# EAGLE design transformer_balancing (EAGLE 7.1.0)
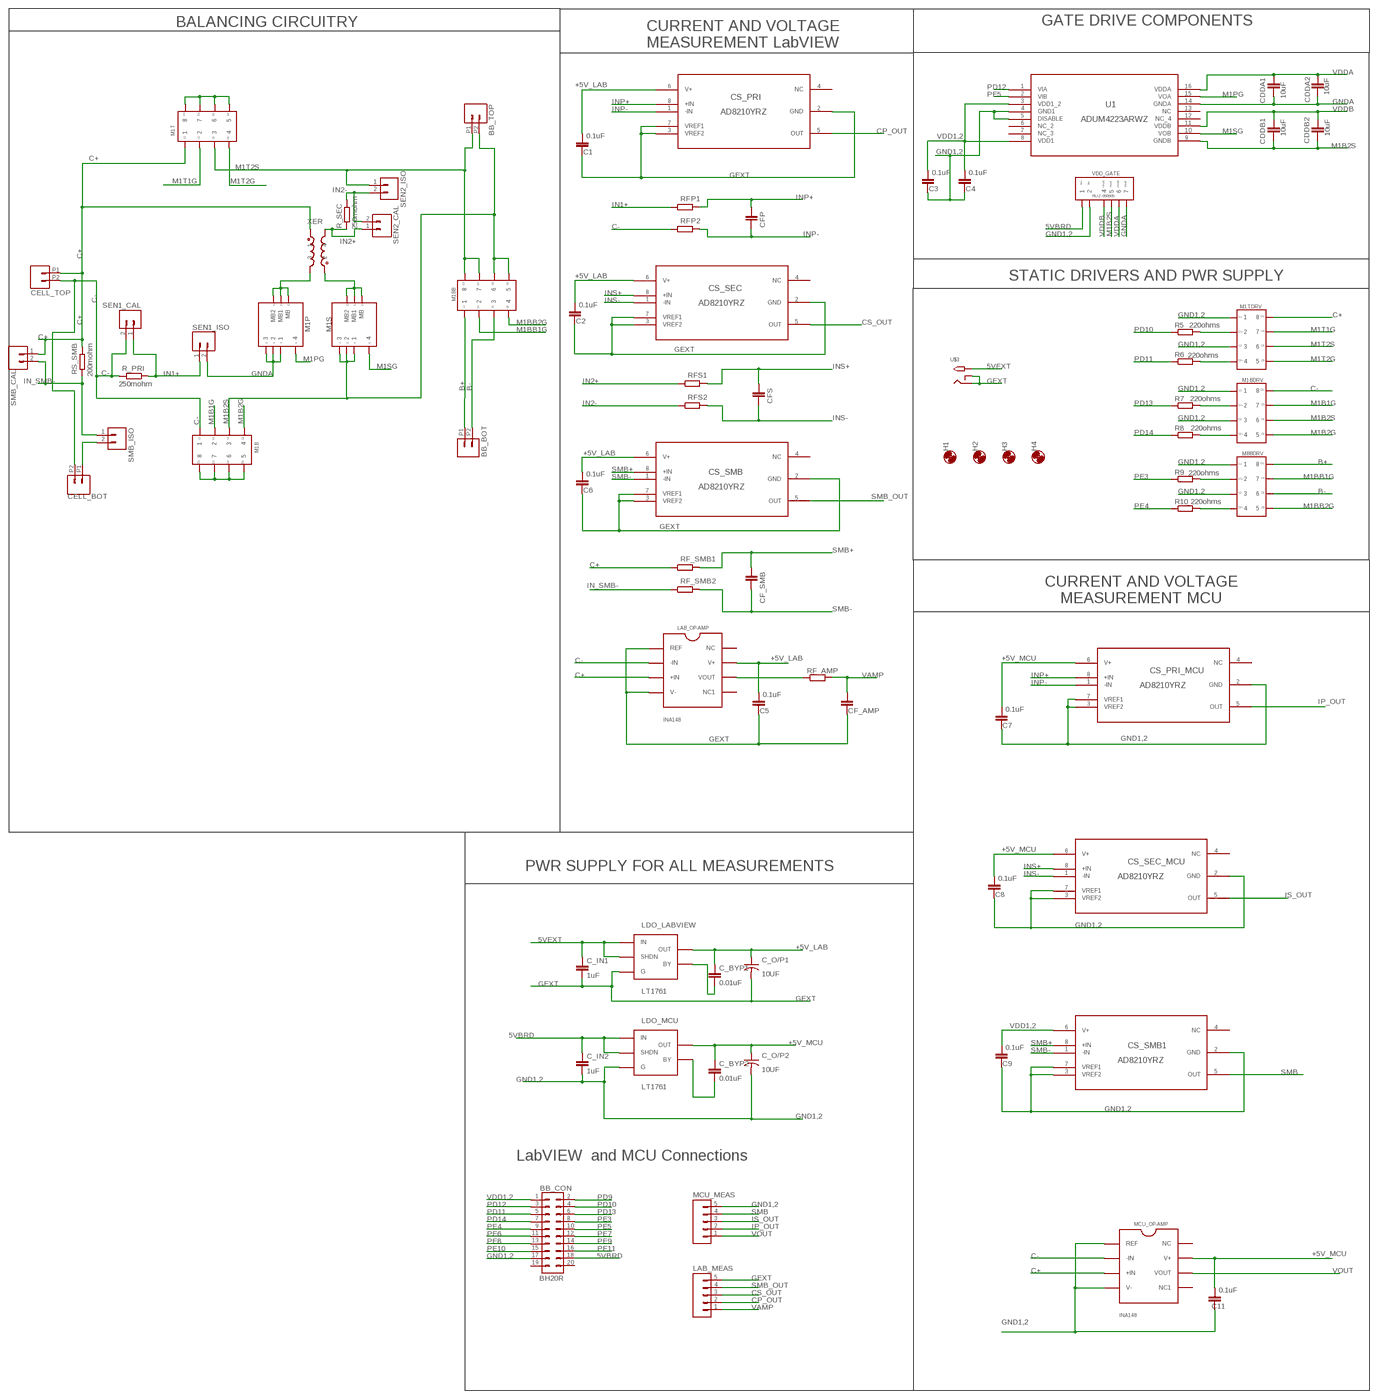
[diagram p0: schematic, sheet 1, overview]
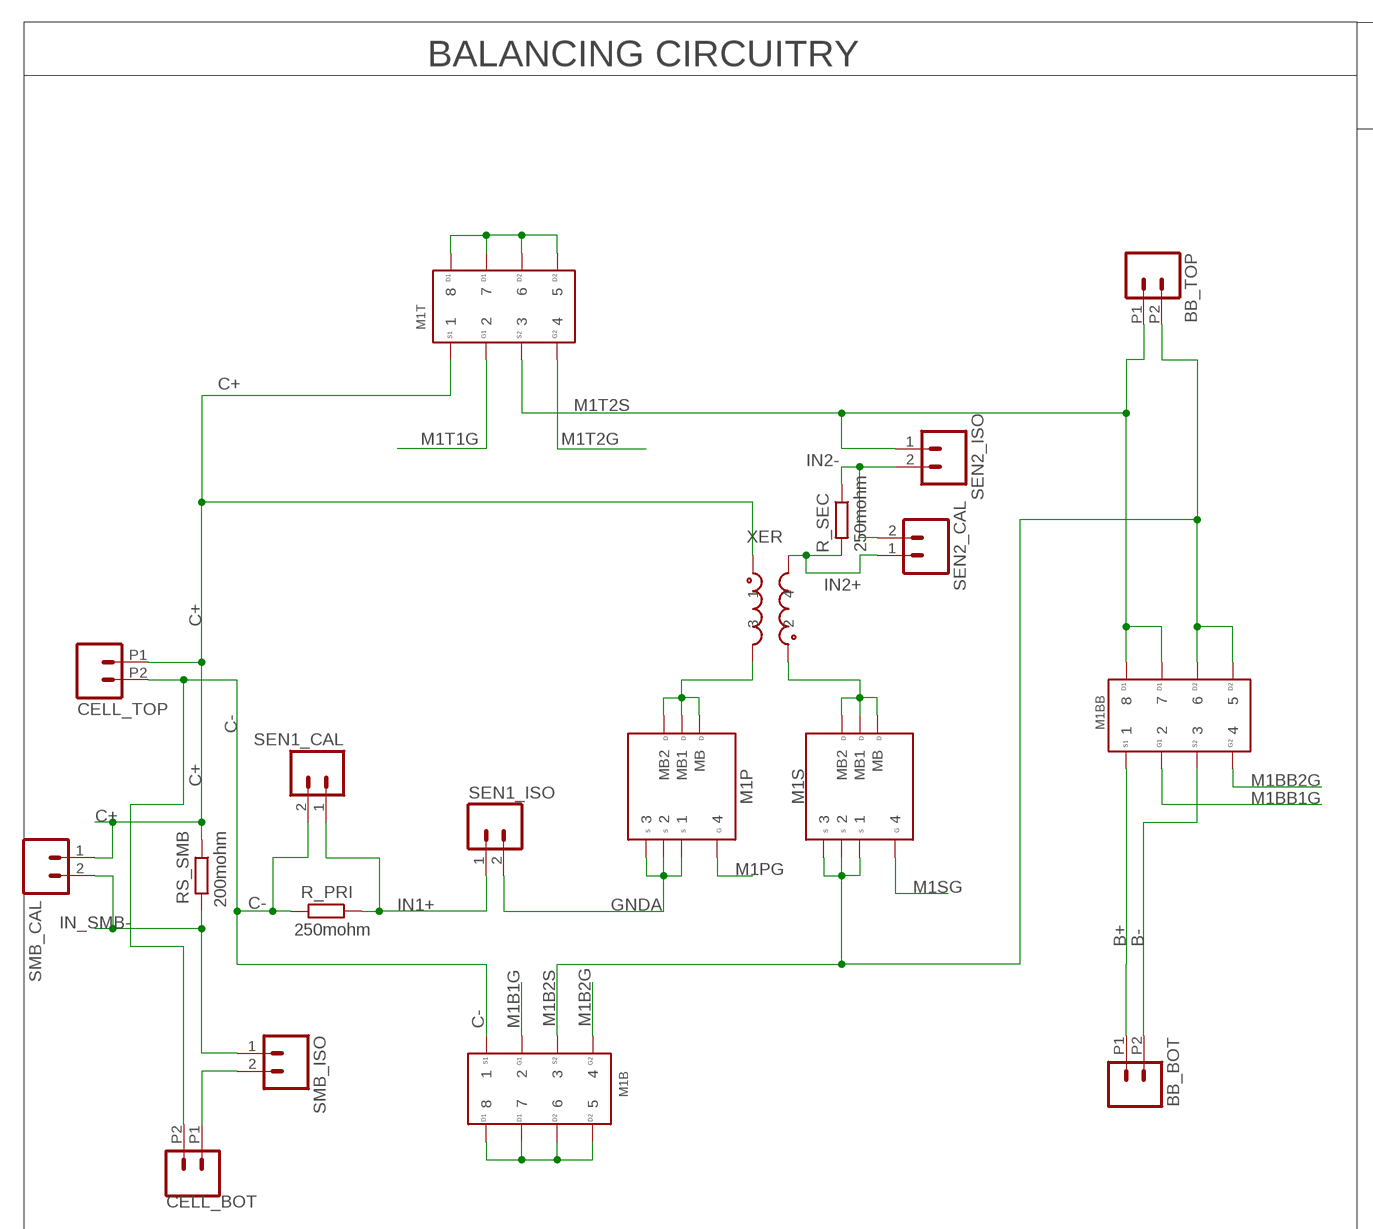
[diagram p1: schematic, sheet 1, part 1 of 4]
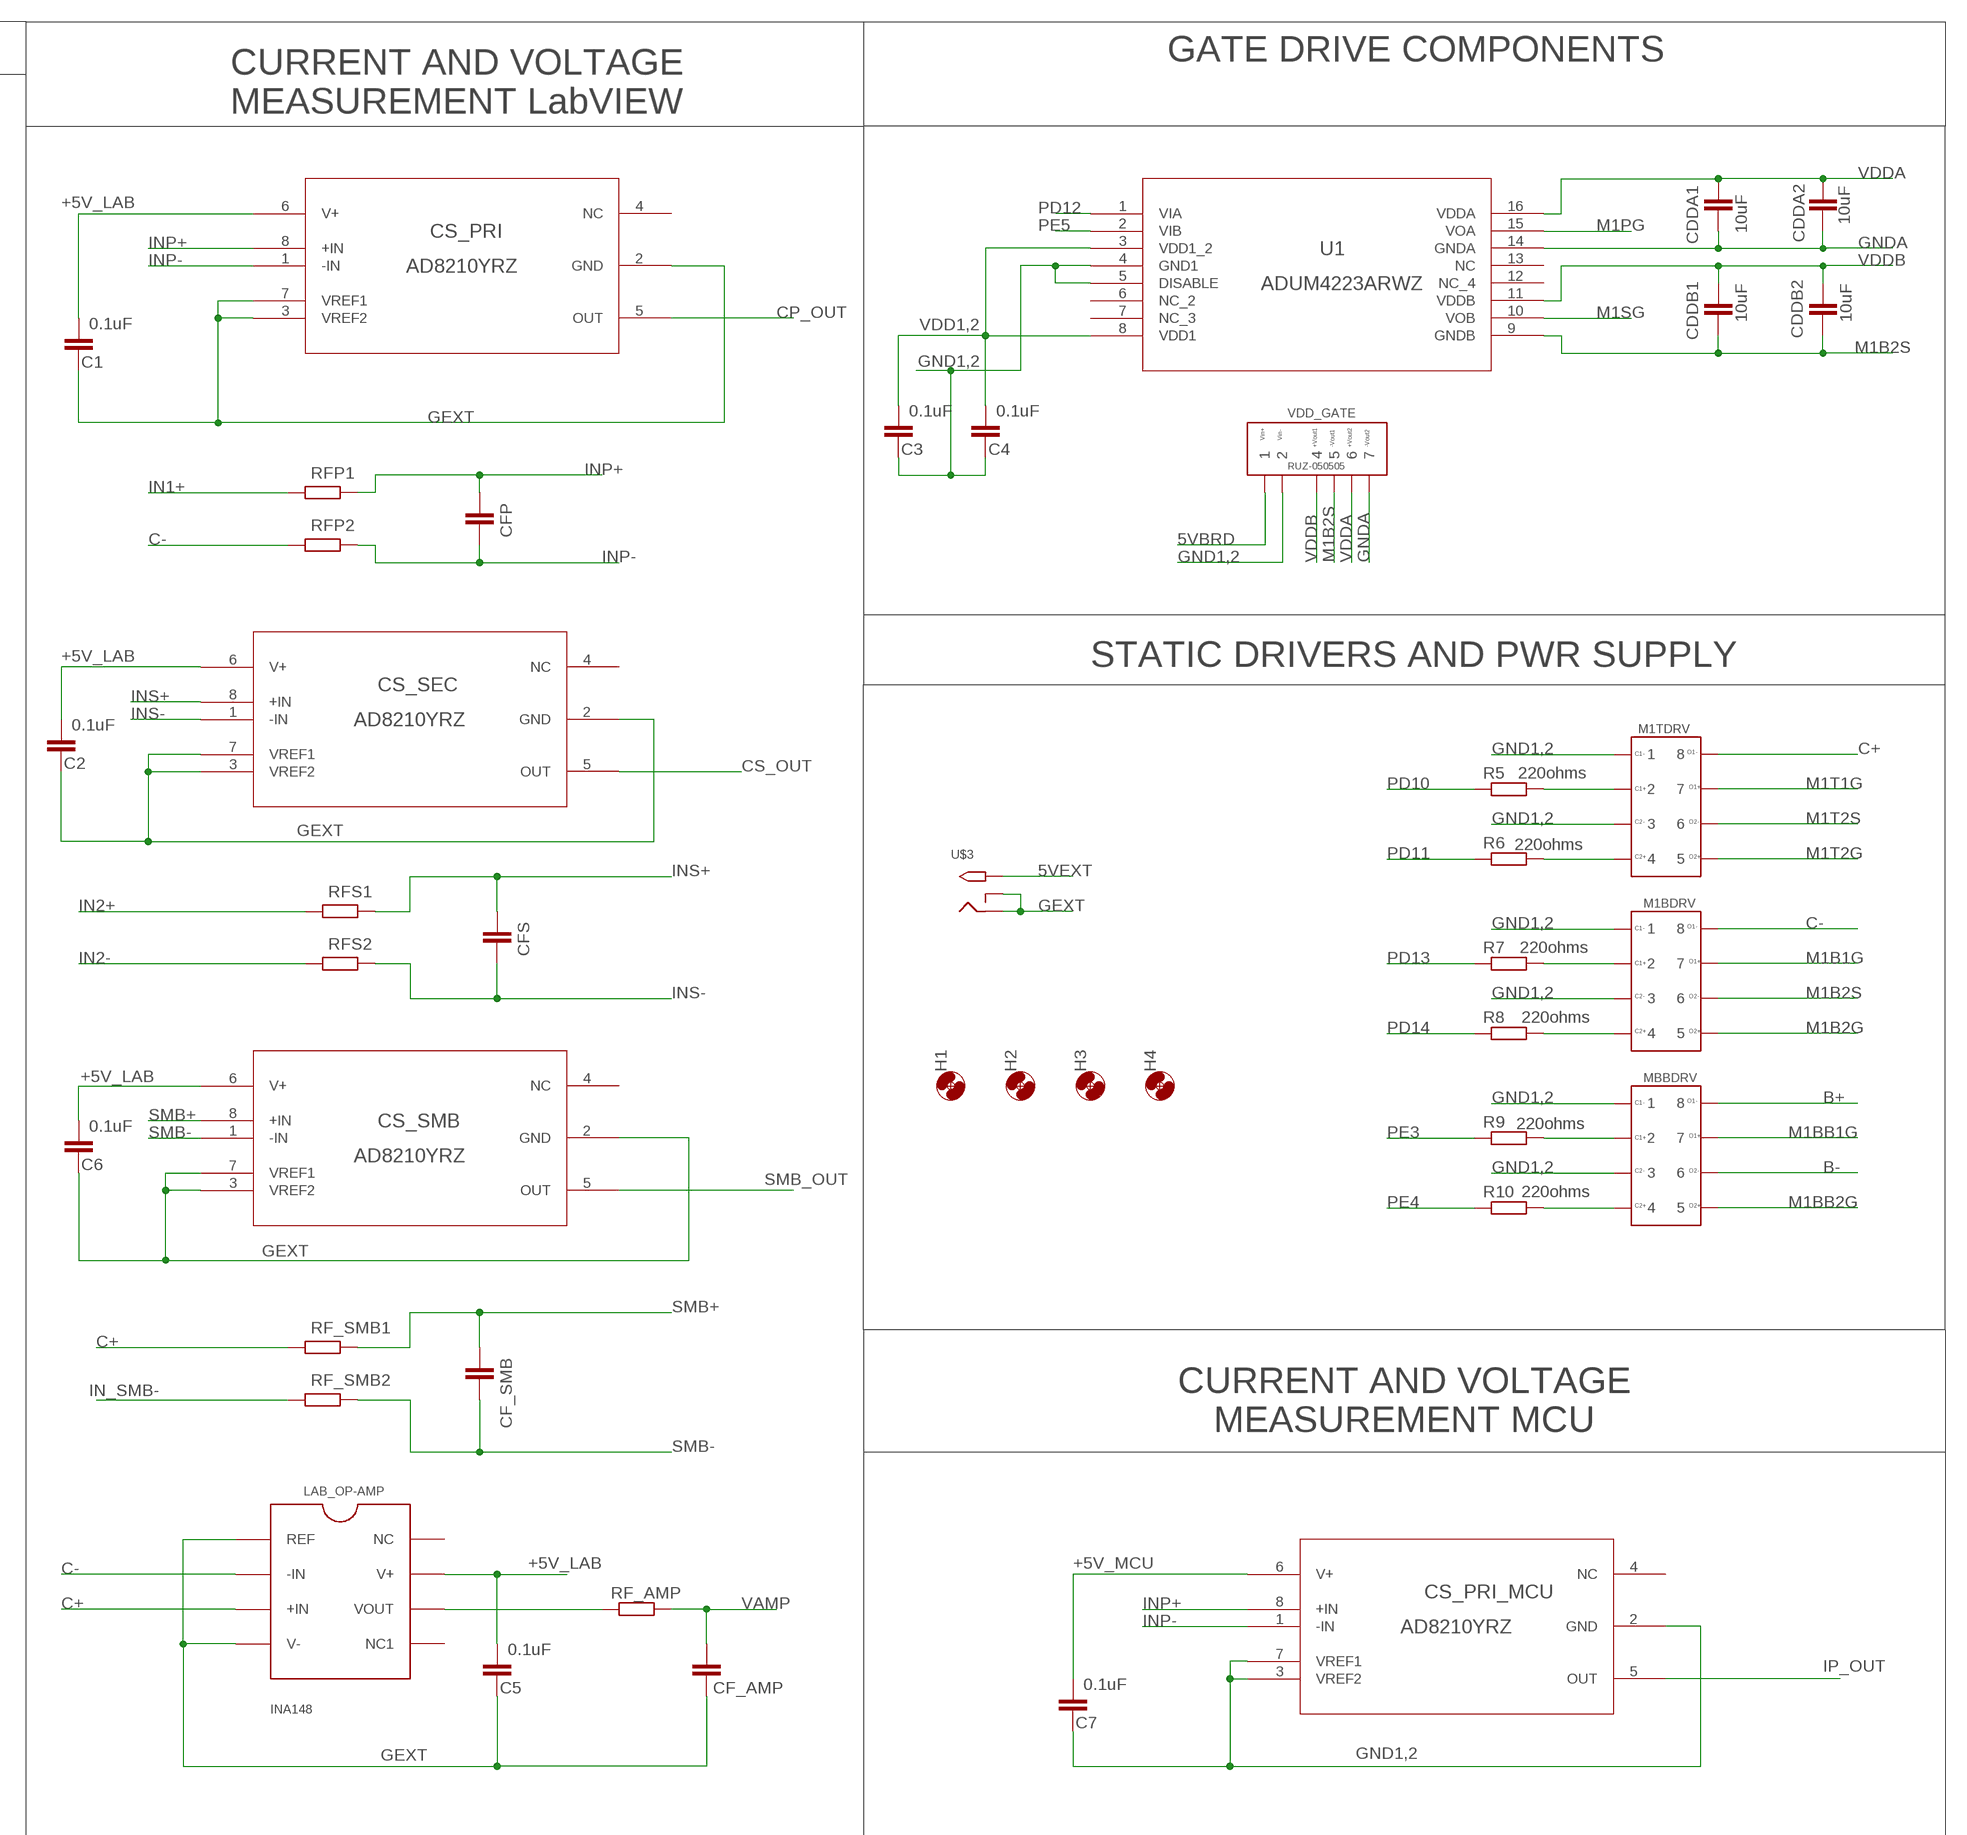
[diagram p2: schematic, sheet 1, part 2 of 4]
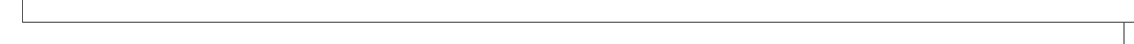
[diagram p3: schematic, sheet 1, part 3 of 4]
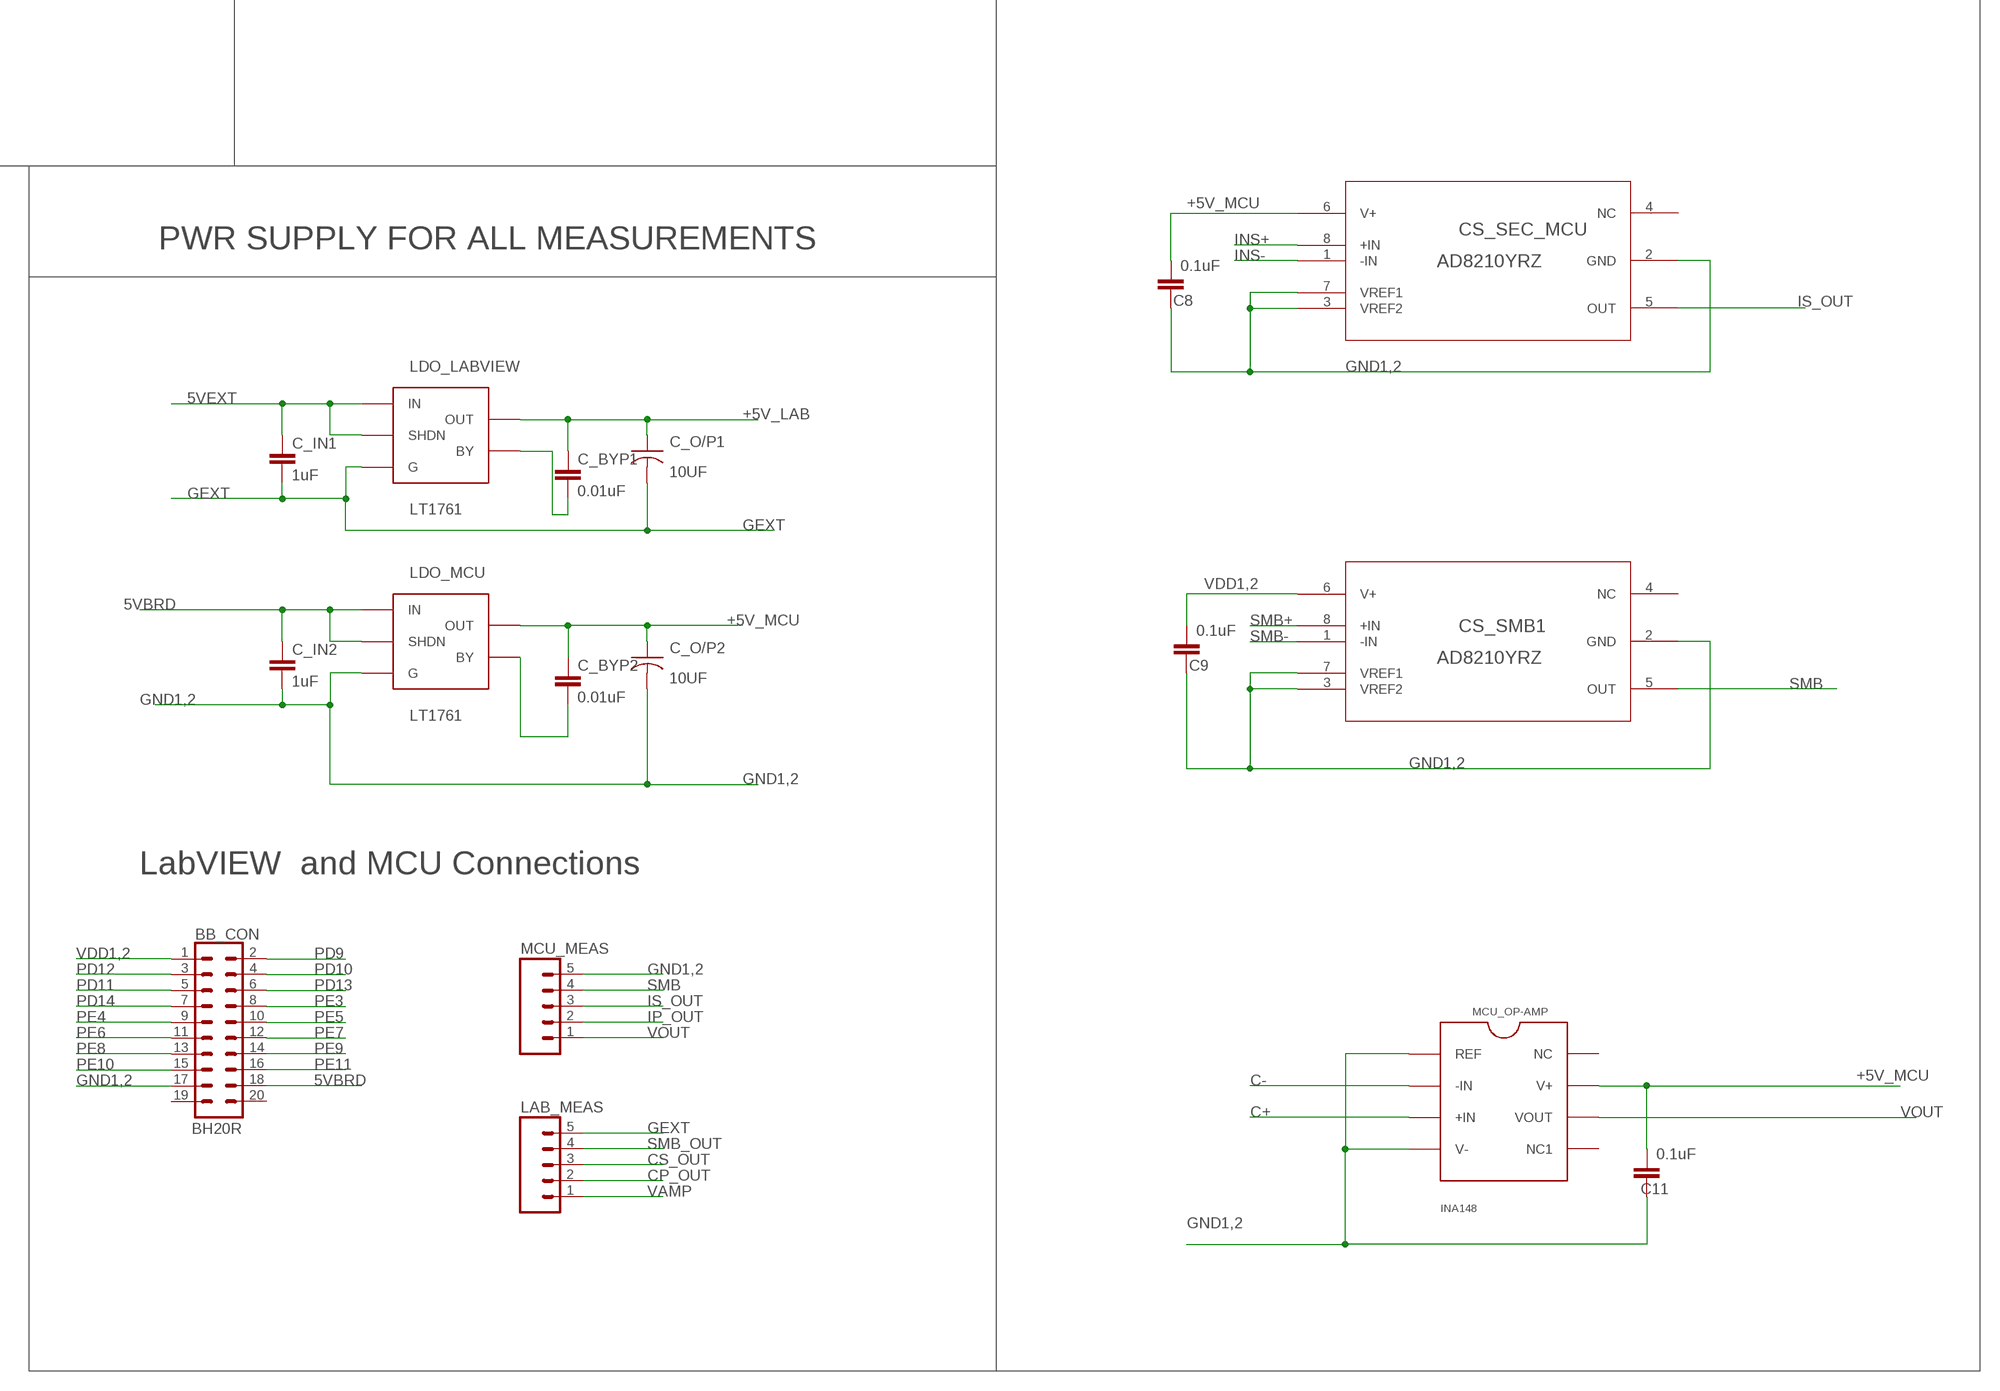
[diagram p4: schematic, sheet 1, part 4 of 4]

## Parts
BB_BOT  M022.54MM_SCREWTERM  [1X02_2.54_SCREWTERM]
BB_CON  BH20R  ML20R  [BH20R]
BB_TOP  M022.54MM_SCREWTERM  [1X02_2.54_SCREWTERM]
C1  0.1uF  C-EUC0603  [C0603]
C2  0.1uF  C-EUC0603  [C0603]
C3  0.1uF  C-EUC0603  [C0603]
C4  0.1uF  C-EUC0603  [C0603]
C5  0.1uF  C-EUC0603  [C0603]
C6  0.1uF  C-EUC0603  [C0603]
C7  0.1uF  C-EUC0603  [C0603]
C8  0.1uF  C-EUC0603  [C0603]
C9  0.1uF  C-EUC0603  [C0603]
C11  0.1uF  C-EUC0603  [C0603]
C_BYP1  0.01uF  C-EUC0402  [C0402]
C_BYP2  0.01uF  C-EUC0402  [C0402]
C_IN1  1uF  C-EUC0402  [C0402]
C_IN2  1uF  C-EUC0402  [C0402]
C_O/P1  10UF  10UF_O/P_LDO  [10UF_O/P_CAP_LDO]
C_O/P2  10UF  10UF_O/P_LDO  [10UF_O/P_CAP_LDO]
CDDA1  10uF  C-EUC0603  [C0603]
CDDA2  10uF  C-EUC0603  [C0603]
CDDB1  10uF  C-EUC0603  [C0603]
CDDB2  10uF  C-EUC0603  [C0603]
CELL_BOT  M022.54MM_SCREWTERM  [1X02_2.54_SCREWTERM]
CELL_TOP  M022.54MM_SCREWTERM  [1X02_2.54_SCREWTERM]
CF_AMP  C-EUC0603  [C0603]
CF_SMB  C-EUC0603  [C0603]
CFP  C-EUC0603  [C0603]
CFS  C-EUC0603  [C0603]
CS_PRI  AD8210YRZ  [R_8]
CS_PRI_MCU  AD8210YRZ  [R_8]
CS_SEC  AD8210YRZ  [R_8]
CS_SEC_MCU  AD8210YRZ  [R_8]
CS_SMB  AD8210YRZ  [R_8]
CS_SMB1  AD8210YRZ  [R_8]
H1  MOUNT-HOLE3.0  [3,0]
H2  MOUNT-HOLE3.0  [3,0]
H3  MOUNT-HOLE3.0  [3,0]
H4  MOUNT-HOLE3.0  [3,0]
LAB_MEAS  M05PTH  [1X05]
LAB_OP-AMP  INA148  [INA148]
LDO_LABVIEW  LT1761  [LT1761]
LDO_MCU  LT1761  [LT1761]
M1B  2_CHANNEL_MOSFET  [2_CHANNEL_MOSFET]
M1BB  2_CHANNEL_MOSFET  [2_CHANNEL_MOSFET]
M1BDRV  VOA1263  [VOA1263]
M1P  SWITCHING_MOSFET  [SWITCHING_MOSFET]
M1S  SWITCHING_MOSFET  [SWITCHING_MOSFET]
M1T  2_CHANNEL_MOSFET  [2_CHANNEL_MOSFET]
M1TDRV  VOA1263  [VOA1263]
MBBDRV  VOA1263  [VOA1263]
MCU_MEAS  M05PTH  [1X05]
MCU_OP-AMP  INA148  [INA148]
R5  220ohms  R-EU_R0603  [R0603]
R6  220ohms  R-EU_R0603  [R0603]
R7  220ohms  R-EU_R0603  [R0603]
R8  220ohms  R-EU_R0603  [R0603]
R9  220ohms  R-EU_R0603  [R0603]
R10  220ohms  R-EU_R0603  [R0603]
R_PRI  250mohm  R-EU_R0603  [R0603]
R_SEC  250mohm  R-EU_R0603  [R0603]
RF_AMP  R-EU_R0603  [R0603]
RF_SMB1  5R  R-EU_R0603  [R0603]
RF_SMB2  5R  R-EU_R0603  [R0603]
RFP1  5R  R-EU_R0603  [R0603]
RFP2  5R  R-EU_R0603  [R0603]
RFS1  5R  R-EU_R0603  [R0603]
RFS2  5R  R-EU_R0603  [R0603]
RS_SMB  200mohm  R-EU_R0603  [R0603]
SEN1_CAL  M02PTH  [1X02]
SEN1_ISO  M02PTH  [1X02]
SEN2_CAL  M02PTH  [1X02]
SEN2_ISO  M02PTH  [1X02]
SMB_CAL  M02PTH  [1X02]
SMB_ISO  M02PTH  [1X02]
U1  ADUM4223ARWZ  [RW_16]
U$3  2.1MMJACK  [PJ-102A]
VDD_GATE  RUZ-050505  [RUZ-050505]
XER  COUPLED_INDUCTOR  [COUPLED_INDUCTOR]

## Nets
5VBRD: BB_CON.18 C_IN2.1 LDO_MCU.1(IN) LDO_MCU.3(SHDN) VDD_GATE.1
5VEXT: C_IN1.1 LDO_LABVIEW.1(IN) LDO_LABVIEW.3(SHDN) U$3.TIP
+5V_LAB: C1.1 C2.1 C5.1 C6.1 C_BYP1.1 C_O/P1.1 CS_PRI.6(V+) CS_SEC.6(V+) CS_SMB.6(V+) LAB_OP-AMP.V+ LDO_LABVIEW.5(OUT)
+5V_MCU: C7.1 C8.1 C11.1 C_BYP2.1 C_O/P2.1 CS_PRI_MCU.6(V+) CS_SEC_MCU.6(V+) LDO_MCU.5(OUT) MCU_OP-AMP.V+
B+: BB_BOT.P1 M1BB.1 MBBDRV.8
B-: BB_BOT.P2 M1BB.3 MBBDRV.6
C+: CELL_TOP.P1 LAB_OP-AMP.+IN M1T.1 M1TDRV.8 MCU_OP-AMP.+IN RF_SMB1.1 RS_SMB.1 SMB_CAL.1 XER.1
C-: CELL_BOT.P2 CELL_TOP.P2 LAB_OP-AMP.-IN M1B.1 M1BDRV.8 MCU_OP-AMP.-IN R_PRI.2 RFP2.1 SEN1_CAL.2
CP_OUT: CS_PRI.5(OUT) LAB_MEAS.2
CS_OUT: CS_SEC.5(OUT) LAB_MEAS.3
GEXT: C1.2 C2.2 C5.2 C6.2 C_IN1.2 C_O/P1.2 CF_AMP.2 CS_PRI.2(GND) CS_PRI.3(VREF2) CS_PRI.7(VREF1) CS_SEC.2(GND) CS_SEC.3(VREF2) CS_SEC.7(VREF1) CS_SMB.2(GND) CS_SMB.3(VREF2) CS_SMB.7(VREF1) LAB_MEAS.5 LAB_OP-AMP.REF LAB_OP-AMP.V- LDO_LABVIEW.2(G) U$3.RING U$3.RING_SW
GND1,2: BB_CON.17 C3.2 C4.2 C7.2 C8.2 C9.2 C11.2 C_IN2.2 C_O/P2.2 CS_PRI_MCU.2(GND) CS_PRI_MCU.3(VREF2) CS_PRI_MCU.7(VREF1) CS_SEC_MCU.2(GND) CS_SEC_MCU.3(VREF2) CS_SEC_MCU.7(VREF1) CS_SMB1.2(GND) CS_SMB1.3(VREF2) CS_SMB1.7(VREF1) LDO_MCU.2(G) M1BDRV.1 M1BDRV.3 M1TDRV.1 M1TDRV.3 MBBDRV.1 MBBDRV.3 MCU_MEAS.5 MCU_OP-AMP.REF MCU_OP-AMP.V- U1.4(GND1) U1.5(DISABLE) VDD_GATE.2
GNDA: CDDA1.2 CDDA2.2 M1P.1 M1P.2 M1P.3 SEN1_ISO.2 U1.14(GNDA) VDD_GATE.7
IN1+: R_PRI.1 RFP1.1 SEN1_CAL.1 SEN1_ISO.1
IN2+: R_SEC.2 RFS1.1 SEN2_CAL.1 XER.4
IN2-: R_SEC.1 RFS2.1 SEN2_CAL.2 SEN2_ISO.2
IN_SMB-: RF_SMB2.1 RS_SMB.2 SMB_CAL.2 SMB_ISO.1
INP+: CFP.1 CS_PRI.8(+IN) CS_PRI_MCU.8(+IN) RFP1.2
INP-: CFP.2 CS_PRI.1(-IN) CS_PRI_MCU.1(-IN) RFP2.2
INS+: CFS.1 CS_SEC.8(+IN) CS_SEC_MCU.8(+IN) RFS1.2
INS-: CFS.2 CS_SEC.1(-IN) CS_SEC_MCU.1(-IN) RFS2.2
IP_OUT: CS_PRI_MCU.5(OUT) MCU_MEAS.2
IS_OUT: CS_SEC_MCU.5(OUT) MCU_MEAS.3
M1B1G: M1B.2 M1BDRV.7
M1B2G: M1B.4 M1BDRV.5
M1B2S: BB_TOP.P2 CDDB1.2 CDDB2.2 M1B.3 M1BB.5 M1BB.6 M1BDRV.6 M1S.1 M1S.2 M1S.3 U1.9(GNDB) VDD_GATE.5
M1BB1G: M1BB.2 MBBDRV.7
M1BB2G: M1BB.4 MBBDRV.5
M1PG: M1P.4 U1.15(VOA)
M1SG: M1S.4 U1.10(VOB)
M1T1G: M1T.2 M1TDRV.7
M1T2G: M1T.4 M1TDRV.5
M1T2S: BB_TOP.P1 M1BB.7 M1BB.8 M1T.3 M1TDRV.6 SEN2_ISO.1
N$1: M1T.5 M1T.6 M1T.7 M1T.8
N$2: M1TDRV.2 R5.2
N$3: M1P.MB M1P.MB1 M1P.MB2 XER.3
N$4: M1TDRV.4 R6.2
N$5: M1B.5 M1B.6 M1B.7 M1B.8
N$6: MBBDRV.2 R9.2
N$7: M1S.MB M1S.MB1 M1S.MB2 XER.2
N$8: MBBDRV.4 R10.2
N$9: M1BDRV.4 R8.2
N$10: LAB_OP-AMP.VOUT RF_AMP.1
N$11: M1BDRV.2 R7.2
N$13: CELL_BOT.P1 SMB_ISO.2
N$21: C_BYP1.2 LDO_LABVIEW.4(BY)
N$23: C_BYP2.2 LDO_MCU.4(BY)
PD9: BB_CON.2
PD10: BB_CON.4 R5.1
PD11 [thin]: BB_CON.5 R6.1
PD12: BB_CON.3 U1.1(VIA)
PD13: BB_CON.6 R7.1
PD14: BB_CON.7 R8.1
PE3: BB_CON.8 R9.1
PE4: BB_CON.9 R10.1
PE5: BB_CON.10 U1.2(VIB)
PE6: BB_CON.11
PE7 [thin]: BB_CON.12
PE8 [thin]: BB_CON.13
PE9: BB_CON.14
PE10: BB_CON.15
PE11: BB_CON.16
SMB: CS_SMB1.5(OUT) MCU_MEAS.4
SMB+: CF_SMB.1 CS_SMB1.8(+IN) CS_SMB.8(+IN) RF_SMB1.2
SMB-: CF_SMB.2 CS_SMB1.1(-IN) CS_SMB.1(-IN) RF_SMB2.2
SMB_OUT: CS_SMB.5(OUT) LAB_MEAS.4
VAMP: CF_AMP.1 LAB_MEAS.1 RF_AMP.2
VDD1,2: BB_CON.1 C3.1 C4.1 C9.1 CS_SMB1.6(V+) U1.3(VDD1_2) U1.8(VDD1)
VDDA: CDDA1.1 CDDA2.1 U1.16(VDDA) VDD_GATE.6
VDDB: CDDB1.1 CDDB2.1 U1.11(VDDB) VDD_GATE.4
VOUT: MCU_MEAS.1 MCU_OP-AMP.VOUT
Unconnected: BB_CON.19 BB_CON.20 CS_PRI.4(NC) CS_PRI_MCU.4(NC) CS_SEC.4(NC) CS_SEC_MCU.4(NC) CS_SMB1.4(NC) CS_SMB.4(NC) LAB_OP-AMP.NC LAB_OP-AMP.NC1 MCU_OP-AMP.NC MCU_OP-AMP.NC1 U1.6(NC_2) U1.7(NC_3) U1.12(NC_4) U1.13(NC)

## Notes on the sheet
- BALANCING CIRCUITRY | GATE DRIVE COMPONENTS
- CURRENT AND VOLTAGE 
  MEASUREMENT LabVIEW
- STATIC DRIVERS AND PWR SUPPLY
- CURRENT AND VOLTAGE
  MEASUREMENT MCU
- PWR SUPPLY FOR ALL MEASUREMENTS
- LabVIEW  and MCU Connections

## Library data of the parts
BB_BOT BB_TOP CELL_BOT CELL_TOP SEN1_CAL SEN1_ISO SEN2_CAL SEN2_ISO SMB_CAL SMB_ISO = SparkFun-Connectors:M02: Standard 2-pin 0.1" header. Use with - straight break away headers ( PRT-00116) - right angle break away headers (PRT-00553) - swiss pins (PRT-00743) - machine pins (PRT-00117) - female headers (PRT-00115) Molex polarized connector foot print use with: PRT-08233 with associated crimp pins and housings. 2.54_SCREWTERM for use with PRT-10571. 3.5mm Screw Terminal footprints for PRT-08084 5mm Screw Terminal footprints for use with PRT-08433
BB_CON = con-harting-ml:ML20: HARTING
C1-C9 C11 CDDA1 CDDA2 CDDB1 CDDB2 CF_AMP CF_SMB CFP CFS = resistor:C-EU: CAPACITOR, European symbol; SPICEPREFIX: C
C_BYP1 C_BYP2 C_IN1 C_IN2 = rcl:C-EU: CAPACITOR, European symbol
C_O/P1 C_O/P2 = transformer_Balancing:10UF_O/P_LDO
CS_PRI CS_PRI_MCU CS_SEC CS_SEC_MCU CS_SMB CS_SMB1 = SmartCellPrototype:AD8210YRZ
H1-H4 = holes:MOUNT-HOLE: MOUNTING HOLE with drill center marker
LAB_MEAS MCU_MEAS = SparkFun-Connectors:M05: Header 5 Standard 5-pin 0.1" header. Use with straight break away headers (SKU : PRT-00116), right angle break away headers (PRT-00553), swiss pins (PRT-00743), machine pins (PRT-00117), and female headers (PRT-00115). Molex polarized connector foot print use with SKU : PRT-08230 with associated crimp pins and housings.
LAB_OP-AMP MCU_OP-AMP = SmartCellPrototype:INA148
LDO_LABVIEW LDO_MCU = transformer_Balancing:LT1761
M1B M1BB M1T = transformer_Balancing:2_CHANNEL_MOSFET
M1BDRV M1TDRV MBBDRV = transformer_Balancing:VOA1263
M1P M1S = transformer_Balancing:SWITCHING_MOSFET
R5-R10 RF_AMP = resistor:R-EU_: RESISTOR, European symbol; SPICEPREFIX: R
R_PRI R_SEC RF_SMB1 RF_SMB2 RFP1 RFP2 RFS1 RFS2 RS_SMB = rcl:R-EU_: RESISTOR, European symbol
U1 = transformer_Balancing:ADUM4223ARWZ
U$3 = adafruit:2.1MMJACK: 2.1mm x 5.5mm DC jack with internal switch. Digikey part #PJ-102A, 4UCON part #05537 By microbuilder.eu
VDD_GATE = transformer_Balancing:RUZ-050505
XER = transformer_Balancing:COUPLED_INDUCTOR

## Net classes
2 thin: width 0.025 mm, clearance 0.025 mm

## Board
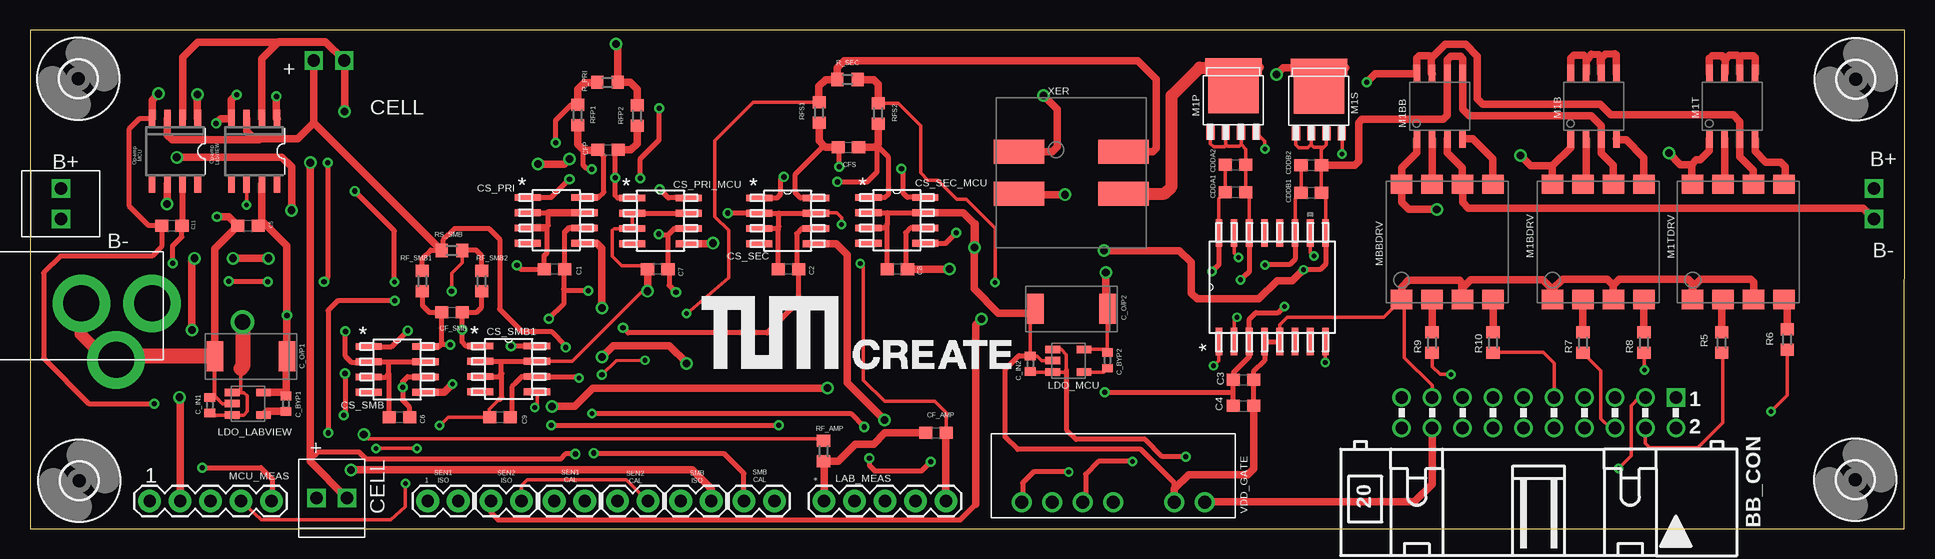
[diagram p5: board, top side]
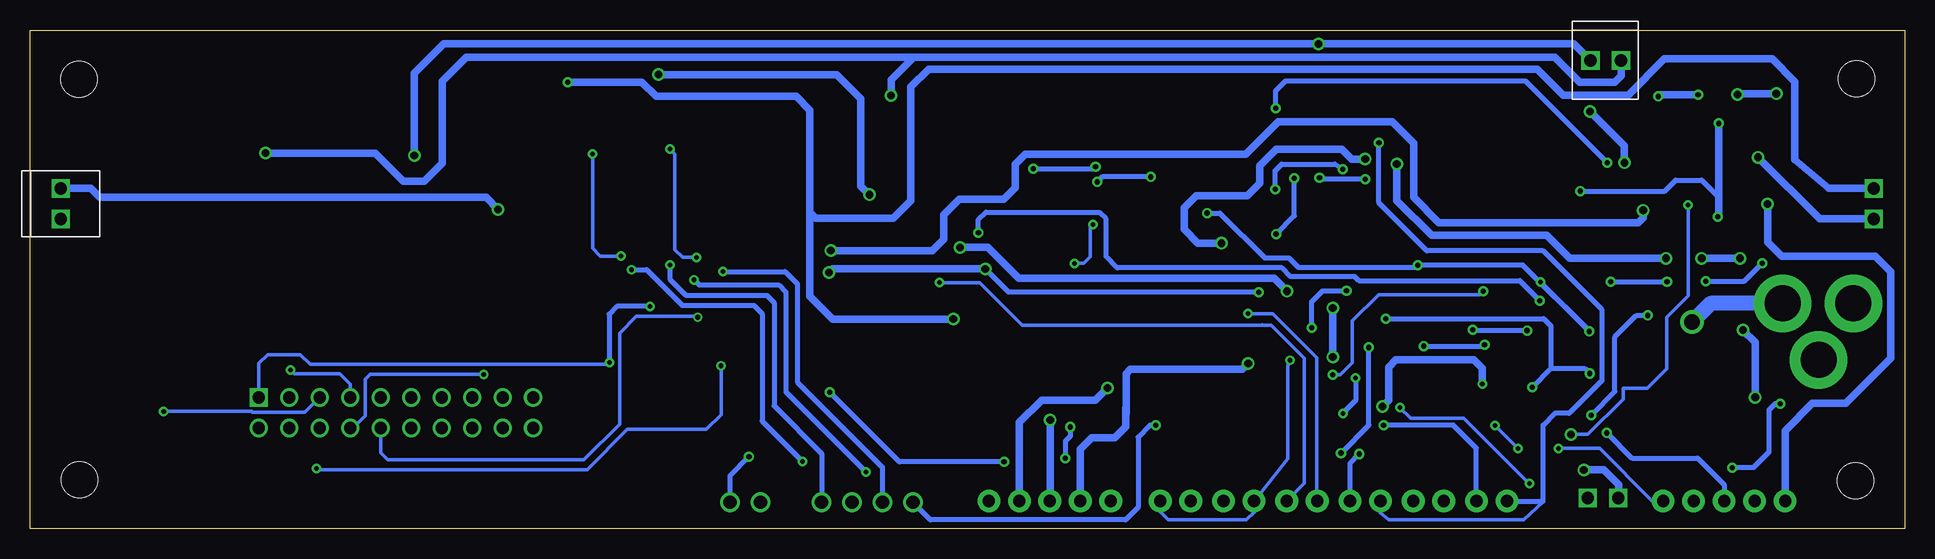
[diagram p6: board, bottom side, seen from below]

Size 156.23 x 41.54 mm. Coordinates in mm from the lower left corner, seen from the top.
Outline: 0,0 156.19,0 156.23,41.54 0,41.54 0,0
Copper layers (1*16): Top 0.0356mm / dielectric 1.5011mm / Bottom 0.0356mm
Design rules "SilverCircuits": minimum track width 7mil, minimum drill 14mil, track to track 7mil, track to pad 7mil, pad to pad 7mil, via to via 7mil, smd to smd 0mil, copper to edge 20mil, drill to drill 8mil, minimum pad ring 10mil, minimum via ring 8mil, stop-mask expansion 4mil, vias tented up to drill 0mil, thermal gap 10mil

### Footprints (pad centres in the part's own frame; a part is rotated, then mirrored left to right if it is on the bottom)
1X02_2.54_SCREWTERM = drill 1.016 square: P1 2.54,0; P2 0,0
BH20R = drill 1.016 square: 1 -11.43,-1.27 | drill 1.016: 2 -11.43,1.27; 3 -8.89,-1.27; 4 -8.89,1.27; 5 -6.35,-1.27; 6 -6.35,1.27; 7 -3.81,-1.27; 8 -3.81,1.27; 9 -1.27,-1.27; 10 -1.27,1.27; 11 1.27,-1.27; 12 1.27,1.27; 13 3.81,-1.27; 14 3.81,1.27; 15 6.35,-1.27; 16 6.35,1.27; 17 8.89,-1.27; 18 8.89,1.27; 19 11.43,-1.27; 20 11.43,1.27
C0603 = smd 1.1 x 1: 1 -0.85,0; 2 0.85,0
C0402 = smd 0.7 x 0.9: 1 -0.65,0; 2 0.65,0
10UF_O/P_CAP_LDO = smd 1.4 x 2.5: 1 -3,0; 2 3,0
R_8 = smd 2.184 x 0.559: 1 -2.362,1.905; 2 -2.362,0.635; 3 -2.362,-0.635; 4 -2.362,-1.905; 5 2.362,-1.905; 6 2.362,-0.635; 7 2.362,0.635; 8 2.362,1.905
3,0 = hole 3: 0,0
1X05 = drill 1.016 pad 1.88: 1 0,0; 2 2.54,0; 3 5.08,0; 4 7.62,0; 5 10.16,0
INA148 = smd 0.55 x 1.5: +IN 0.635,-2.7; -IN -0.635,-2.7; NC -1.905,2.7; NC1 1.905,2.7; REF -1.905,-2.7; V+ -0.635,2.7; V- 1.905,-2.7; VOUT 0.635,2.7
LT1761 = smd 0.62 x 1.22: 1 -0.95,-1.31; 2 0,-1.31; 3 0.95,-1.31; 4 0.95,1.31; 5 -0.95,1.31
2_CHANNEL_MOSFET = smd 0.55 x 1.5: 1 -1.905,-2.7; 2 -0.635,-2.7; 3 0.635,-2.7; 4 1.905,-2.7; 5 1.905,2.7; 6 0.635,2.7; 7 -0.635,2.7; 8 -1.905,2.7
VOA1263 = smd 1.6 x 1.8: 1 -4.8,3.81; 2 -4.8,1.27; 3 -4.8,-1.27; 4 -4.8,-3.81; 5 4.8,-3.81; 6 4.8,-1.27; 7 4.8,1.27; 8 4.8,3.81
SWITCHING_MOSFET = smd 0.7 x 1.15: 1 -1.905,-2.725; 2 -0.635,-2.725; 3 0.635,-2.725; 4 1.905,-2.725 | smd 4.2 x 4.6: MB 0,1.2 | smd 0.25 x 1.5: MB1 -2.225,2.75; MB2 2.225,2.75
R0603 = smd 1 x 1.1: 1 -0.85,0; 2 0.85,0
1X02 = drill 1.016 pad 1.88: 1 0,0; 2 2.54,0
RW_16 = smd 2.286 x 0.559: 1 -4.528,4.445; 2 -4.528,3.175; 3 -4.528,1.905; 4 -4.528,0.635; 5 -4.528,-0.635; 6 -4.528,-1.905; 7 -4.528,-3.175; 8 -4.528,-4.445; 9 4.528,-4.445; 10 4.528,-3.175; 11 4.528,-1.905; 12 4.528,-0.635; 13 4.528,0.635; 14 4.528,1.905; 15 4.528,3.175; 16 4.528,4.445
PJ-102A = drill 3 pad 4.8: RING 0.1,-3.39; RING_SW -4.6,-6.29; TIP 0.1,-9.29
RUZ-050505 = drill 1.1: 1 -5.08,0; 2 -2.54,0; 4 2.54,0; 5 5.08,0; 6 7.62,0; 7 10.16,0
COUPLED_INDUCTOR = smd 2 x 4.2: 1 1.75,4.35; 2 -1.75,4.35; 3 -1.75,-4.35; 4 1.75,-4.35

### Placement (x,y rotation side)
BB_BOT  153.67,25.79 90 bottom
BB_CON  125.73,9.65 180 top
BB_TOP  2.58,25.79 90 top
C1  43.7,21.6 180 top
C2  63.21,21.6 180 top
C3  101.12,12.38 0 top
C4  101.12,10.21 0 top
C5  18.17,25.22 180 top
C6  30.78,9.26 180 top
C7  52.31,21.6 180 top
C8  72.28,21.6 180 top
C9  39.17,9.26 180 top
C11  11.82,25.22 180 top
C_BYP1  21.34,10.4 270 top
C_BYP2  89.79,14.01 270 top
C_IN1  14.99,10.27 90 top
C_IN2  83.36,13.73 90 top
C_O/P1  18.41,14.34 180 top
C_O/P2  86.79,18.3 180 top
CDDA1  100.46,28.03 0 top
CDDA2  100.46,30.31 0 top
CDDB1  106.77,27.99 0 top
CDDB2  106.77,30.28 0 top
CELL_BOT  26.42,2.54 180 top
CELL_TOP  26.19,39 0 bottom
CF_AMP  75.5,7.96 0 top
CF_SMB  35.17,18.02 0 top
CFP  48.16,31.55 0 top
CFS  68.2,31.78 0 top
CS_PRI  43.85,25.68 0 top
CS_PRI_MCU  52.54,25.64 0 top
CS_SEC  63.13,25.64 0 top
CS_SEC_MCU  72.24,25.68 0 top
CS_SMB  30.59,13.26 0 top
CS_SMB1  39.89,13.3 0 top
H1  4.03,37.48 0 top
H2  152.15,37.44 0 top
H3  152.11,4.06 0 top
H4  4.1,3.99 0 top
LAB_MEAS  66.17,2.29 0 top
LAB_OP-AMP  18.68,31.45 180 top
LDO_LABVIEW  18.16,10.4 270 top
LDO_MCU  86.54,13.98 270 top
M1B  130.3,35.18 0 top
M1BB  117.47,35.18 0 top
M1BDRV  130.68,23.88 90 top
M1P  100.28,35.7 0 top
M1S  107.4,35.65 0 top
M1T  141.86,35.18 0 top
M1TDRV  142.37,23.88 90 top
MBBDRV  118.11,23.88 90 top
MCU_MEAS  9.97,2.29 0 top
MCU_OP-AMP  12.08,31.45 180 top
R5  140.97,15.49 90 top
R6  146.43,15.75 90 top
R7  129.41,15.49 90 top
R8  134.49,15.49 90 top
R9  116.84,15.49 90 top
R10  121.92,15.49 90 top
R_PRI  48.12,37.19 0 top
R_SEC  68.12,37.41 180 top
RF_AMP  66.13,6.45 270 top
RF_SMB1  32.69,20.61 270 top
RF_SMB2  37.64,20.61 270 top
RFP1  45.64,34.44 270 top
RFP2  50.6,34.4 270 top
RFS1  65.76,34.67 270 top
RFS2  70.68,34.59 270 top
RS_SMB  35.15,23.16 0 top
SEN1_CAL  43.69,2.29 0 top
SEN1_ISO  33.15,2.29 0 top
SEN2_CAL  48.96,2.29 0 top
SEN2_ISO  38.42,2.29 0 top
SMB_CAL  59.5,2.29 0 top
SMB_ISO  54.23,2.29 0 top
U1  103.52,20.1 90 top
U$1  [BIGGER_LOGO]  55.24,12.57 0 top
U$3  0.89,18.66 90 top
VDD_GATE  92.81,2.18 180 top
XER  86.77,29.65 90 top

### Tracks (layer width: path | path; a pad name or v marks a point on that pad's centre or on a via)
5VBRD  (via drill 0.43)
  Top 0.305: C_IN2.1 83.41,13.03 LDO_MCU.3 86.18,13.03 86.37,13.22 86.37,14.48 85.92,14.93 LDO_MCU.1
  Top 0.406: 86.37,13.22 86.37,8.23 87.17,7.43 92.93,7.43 94.37,5.98 v96.32,5.98
  Top 0.61: BB_CON.18 116.84,3.68 115.37,2.21 97.92,2.21 VDD_GATE.1
  Bottom 0.406: VDD_GATE.1 97.89,4.41 v96.32,5.98
5VEXT  (via drill 1.3)
  Top 0.305: C_IN1.1 15.16,9.45 LDO_LABVIEW.3 17.8,9.45 18.1,9.75 18.1,11.05 17.83,11.32 17.37,11.32 | 17.37,11.32 16.89,11.32 LDO_LABVIEW.1 | 17.56,13.34 17.56,11.51 17.37,11.32
  Top 1.27: v17.72,17.22 17.72,13.49 17.56,13.34
  Bottom 1.27: U$3.TIP 16.18,18.76 v17.72,17.22
+5V_LAB  (via drill 0.43)
  Top 0.406: CS_SEC.6 64.33,25.01 63.89,24.57 63.89,21.77 C2.1 64.05,21.59 64.05,18.94 61.42,16.31 49.84,16.31 v49.42,16.73 | C1.1 44.55,24.7 44.88,25.03 46.2,25.03 CS_PRI.6 44.9,25.04 44.54,24.69 44.54,21.64 44.46,21.57 44.46,19.96 | C6.1 31.64,9.75 | 31.64,9.75 31.64,10.09 31.05,10.67 v31.05,11.77 31.05,12.23 31.47,12.65 32.93,12.65 CS_SMB.6 | 44.46,19.96 44.46,18.71 v43.24,17.49 | 31.62,9.74 31.64,9.75 | v46.52,19.81 44.62,19.81 44.46,19.96 | v26.25,12.92 26.25,9.49 26.21,9.45 v26.14,9.45
  Top 0.61: C5.1 19.32,25.52 19.32,25.64 | 19.32,25.64 LAB_OP-AMP.V+ | 19.32,25.64 21.41,23.54 v21.41,17.75 C_O/P1.1 21.34,14.26 C_BYP1.1 21.04,11.35 LDO_LABVIEW.5
  Bottom 0.406: v43.24,17.49 30.1,17.49 29.49,16.88 29.49,13.34 | 29.49,13.34 v31.05,11.77 | v49.42,16.73 49.42,18.9 48.5,19.81 v46.52,19.81 | 29.49,13.34 26.67,13.34 v26.25,12.92 | v21.41,17.75 22.36,17.75 24.16,15.96 24.16,11.43 v26.14,9.45
+5V_MCU  (via drill 0.43, 0.64)
  Top 0.305: LDO_MCU.5 89.51,14.93 C_BYP2.1 C_O/P2.1
  Top 0.406: 53.15,21.83 53.15,21.61 C7.1 | CS_SEC_MCU.6 73.36,25.04 72.96,24.65 72.96,21.77 C8.1 | CS_PRI_MCU.6 53.73,25.01 53.15,24.42 | 53.15,24.42 53.15,21.83 | 53.15,21.83 53.26,21.72 53.26,20.27 v53.84,19.7 | 53.15,24.42 52.5,24.42 v52.39,24.54 | v50.86,29.18 50.86,30.82 52.43,32.38 v52.43,35.01 | 12.72,25.26 12.71,25.27 MCU_OP-AMP.V+ 12.67,28.71 C11.1 12.65,25.2 12.65,24.31 11.89,23.55 v11.89,22.1 | v24.8,30.48 24.8,20.88 v24.5,20.57 | v19.81,20.57 16.61,20.57 v16.57,20.61
  Top 0.61: C8.1 76.58,21.6 v76.62,21.64 | v89.65,21.34 89.65,18.44 C_O/P2.1
  Bottom 0.406: v53.84,19.7 74.68,19.7 v76.62,21.64 | v52.39,24.54 50.86,26.06 v50.86,29.18 | v52.43,35.01 52.43,36.46 51.59,37.3 31.62,37.3 v24.8,30.48 | v24.5,20.57 v19.81,20.57 | v16.57,20.61 13.37,20.61 v11.89,22.1
  Bottom 0.61: v76.62,21.64 89.34,21.64 v89.65,21.34
B+  (via drill 0.64)
  Top 0.61: M1BB.1 115.57,31.33 114.3,30.06 MBBDRV.8 114.3,27.2 114.91,26.59 v117.23,26.59
  Bottom 0.61: BB_BOT.P1 151.17,28.33 150.42,27.58 118.22,27.58 v117.23,26.59
B-
  Top 0.61: M1BB.3 118.11,31.32 119.37,30.06 119.37,28.69 MBBDRV.6 119.38,27.19 119.86,26.71 152.76,26.71 BB_BOT.P2
C+  (via drill 0.43, 0.64)
  Top 0.406: RF_SMB1.1 32.69,22.52 33.38,23.2 34.25,23.2 | 34.25,23.2 34.27,23.2 RS_SMB.1 34.4,23.27 34.4,24 35.4,24.99 38.25,24.99 39.13,24.12 39.13,18.29 41.03,16.38 43.51,16.38 44.65,15.24 v44.65,15.09 | 34.25,23.2 34.37,23.09 | SMB_CAL.1 59.5,4.58 57.87,6.21 47.05,6.21 v46.98,6.29
  Top 0.61: M1T.1 139.95,31.48 139.18,30.71 138.88,30.71 138.49,30.33 | 138.49,30.33 138.49,28.74 M1TDRV.8 | 138.49,30.33 137.54,30.33 v136.59,31.28 | XER.1 85.2,31.4 85.61,31.81 85.61,34.94 v84.47,36.08 | 34.37,23.09 23.65,33.81 | 23.65,33.81 CELL_TOP.P1 | LAB_OP-AMP.+IN 18.05,33.08 18.67,32.46 19.16,32.46 | 19.16,32.46 22.3,32.46 23.65,33.81 | MCU_OP-AMP.+IN 11.44,32.79 11.85,32.38 19.09,32.38 19.16,32.46
  Bottom 0.406: v46.98,6.29 44.65,8.61 v44.65,15.09
  Bottom 0.61: v136.59,31.28 127.44,31.28 125.12,28.96 123.37,28.96 121.88,30.44 121.88,37.26 119.86,39.28 82.6,39.28 | 82.6,39.28 29.18,39.28 27.09,37.19 24.16,37.19 23.62,37.72 23.62,38.98 CELL_TOP.P1 | v84.47,36.08 84.47,37.41 82.6,39.28
C-  (via drill 0.43, 0.64)
  Top 0.406: 23.36,5.71 24,6.36 27.43,6.36 28,5.79 44.2,5.79 44.62,6.21 v45.45,6.21
  Top 0.61: M1B.1 128.4,31.74 126.87,30.21 | 126.87,30.21 M1BDRV.8 | 126.87,30.21 125.08,30.21 v124.21,31.09 | RFP2.1 50.6,36.61 50.02,37.19 R_PRI.2 48.97,40.26 v48.84,40.39 | LAB_OP-AMP.-IN 19.32,39.17 20.73,40.58 24.61,40.58 CELL_TOP.P2 | MCU_OP-AMP.-IN 12.71,39.27 13.98,40.54 24.65,40.54 CELL_TOP.P2 | v23.36,30.48 23.36,5.71 23.36,5.6 CELL_BOT.P2 | v26.21,34.75 26.21,38.98 CELL_TOP.P2
  Bottom 0.406: SEN1_CAL.2 46.23,5.44 v45.45,6.21
  Bottom 0.61: v124.21,31.09 124.21,37.95 121.77,40.39 v48.84,40.39 27.57,40.39 CELL_TOP.P2 | v23.36,30.48 23.36,31.89 v26.21,34.75
CP_OUT  (via drill 0.64)
  Top 0.61: v47.66,18.36 47.66,23.36 47.24,23.77 CS_PRI.5 | v47.66,14.29 48.62,15.24 53.26,15.24 54.71,13.79 v54.71,13.75
  Bottom 0.61: LAB_MEAS.2 68.71,6.62 67.74,7.58 65.84,7.58 64.92,8.5 64.92,9.53 | 64.92,9.53 64.92,10.06 | v47.66,14.29 v47.66,18.36 | 64.92,9.53 64.88,9.56 64.88,12.92 64.54,13.26 55.21,13.26 v54.71,13.75
CS_OUT  (via drill 0.64)
  Top 0.61: CS_SEC.5 67.17,23.74 68.08,22.82 68.08,12.15 v71.21,9.03
  Bottom 0.61: v71.21,9.03 71.21,2.32 LAB_MEAS.3
GEXT  (via drill 0.38, 0.43)
  Top 0.305: 15.51,10.94 16.04,10.4 LDO_LABVIEW.2 16,10.4 15.35,11.05 15.35,14.29 15.32,14.33 5.91,14.33 4.15,16.08 4.15,18.75 4.38,18.97 | 15.51,10.94 15,10.94 C_IN1.2 | C_O/P1.2 15.41,11.03 15.51,10.94 | CF_AMP.2 76.35,9.64 75.4,10.59 71.21,10.59 69.46,12.34 69.46,21.83 v69.19,22.1 | v67.63,25.34 67.63,25.91 67.21,26.33 65.55,26.33 CS_SEC.7
  Top 0.406: 62.41,26.28 CS_SEC.2 58.15,26.28 v58.14,26.29 | 62.41,26.28 CS_SEC.7 | CS_SEC.3 62.27,25.01 | 62.27,25.01 62.41,25.15 62.41,26.28 | C2.2 62.36,24.92 62.27,25.01 | CS_PRI.2 43.24,26.31 43.2,26.28 43.2,25.26 42.99,25.04 43.09,24.94 43.09,22.97 42.85,22.73 C1.2 40.92,21.6 v40.58,21.95 | 29.95,13.89 CS_SMB.2 28.21,13.87 26.78,13.87 26.29,14.36 v26.29,16.42 | 29.95,13.89 CS_SMB.7 | CS_SMB.3 29.65,12.62 29.91,12.88 | 29.91,12.88 29.91,13.86 29.95,13.89 | C6.2 29.93,12.85 29.91,12.88 | v30.37,20.54 30.37,24.8 v27.05,28.12
  Top 0.61: LAB_MEAS.5 76.33,7.94 CF_AMP.2 | v17.22,36.16 16.78,35.71 LAB_OP-AMP.V- 15.89,34.15 v15.51,33.76 | v20.54,36.01 20.54,34.2 LAB_OP-AMP.REF | v15.58,25.98 16.56,25.98 C5.2 15.41,23.31 C_O/P1.2 | CS_PRI.7 43.24,26.31 | CS_PRI.3 42.99,25.04
  Top 1.016: 6.37,14.06 4.23,16.19 4.23,18.71 U$3.RING
  Top 1.27: C_O/P1.2 7.46,14.34 U$3.RING_SW 6.37,14.06
  Bottom 0.305: v69.19,22.1 68.43,22.1 67.89,22.63 67.89,25.07 v67.63,25.34
  Bottom 0.406: v30.37,20.54 26.29,16.46 v26.29,16.42 31.81,21.95 v40.58,21.95 40.77,21.75 50.52,21.75 51.32,22.55 53.34,22.55 57.07,26.29 v58.14,26.29 | v27.05,28.12 20,28.12 19.09,29.03 16.92,29.03 15.51,27.62
  Bottom 0.61: v17.22,36.16 20.38,36.16 v20.54,36.01 | v15.51,33.76 15.51,27.62 15.51,26.06 v15.58,25.98
GND1,2  (via drill 0.38, 0.43, 0.64)
  Top 0.305: U1.5 104.15,16.98 104.78,17.6 112.83,17.6 MBBDRV.1 114.53,18.85 114.53,14.25 116.84,11.94 BB_CON.17 | LDO_MCU.2 84.31,13.98 83.93,14.36 83.38,14.36 C_IN2.2 83.36,17.87 C_O/P2.2 | CS_SMB1.7 45.17,13.93 50.9,19.66 51.36,19.66 v51.47,19.77 | 39.12,10.73 39.08,10.73 38.29,9.94 38.29,9.29 | 38.29,9.29 C9.2 | 38.29,9.29 34.85,9.29 v34.14,8.57 | v32.23,6.67 v28.84,6.67 | 51.75,21.89 49.31,21.89 48.54,22.67 48.54,24.84 48.69,24.99 50.16,24.99 CS_PRI_MCU.3 CS_PRI_MCU.2
  Top 0.406: C4.2 C3.2 101.96,12.39 101.96,13.07 102.88,13.99 U1.4 U1.5 | 95.35,3.3 95.35,3.82 92.58,6.59 82.3,6.59 81.27,7.62 81.27,13.26 82.41,14.4 83.34,14.4 C_IN2.2 | CS_PRI_MCU.2 CS_PRI_MCU.7 | 51.75,21.89 C7.2 | 71.48,26.31 CS_SEC_MCU.2 77.85,26.31 78.75,25.41 | 71.48,26.31 CS_SEC_MCU.7 | CS_SEC_MCU.3 71.14,25.04 71.48,25.38 71.48,25.41 | 71.48,25.41 71.48,26.31 | C8.2 71.43,25.36 71.48,25.41 | CS_SMB1.2 39.28,13.93 | 39.28,13.93 CS_SMB1.7 | CS_SMB1.3 39.06,12.66 39.28,12.88 39.28,12.95 | 39.28,12.95 39.28,13.93 | 39.12,10.73 39.32,10.94 39.32,12.92 39.28,12.95 | MCU_OP-AMP.V- 9.11,34.15 8.23,33.26 8.23,26.9 9.87,25.26 10.94,25.26 C11.2 10.97,23.51 10.17,22.71 2.55,22.71 1.14,21.3 1.14,14.17 4.92,10.4 v10.36,10.4 | v14.36,5.07 19.24,5.07 20.19,4.12 20.19,2.35 MCU_MEAS.5
  Top 0.61: M1BDRV.1 126.87,19.93 | 126.87,19.93 127.71,20.77 131.44,20.77 131.94,20.27 M1BDRV.3 131.95,20.28 132.44,20.77 138.19,20.77 138.53,20.42 138.53,19.1 M1TDRV.1 138.56,20.1 139.22,20.77 143.41,20.77 143.64,20.54 M1TDRV.3 | MBBDRV.1 114.3,20.12 114.87,20.69 119.14,20.69 119.33,20.5 119.33,19.13 MBBDRV.3 119.38,20.05 120.05,20.73 126.07,20.73 126.87,19.93 | VDD_GATE.2 95.35,3.3 96.55,4.5 101.5,4.5 101.99,4.99 101.99,10.18 C4.2 | CS_SEC_MCU.7 77.78,26.31 78.68,25.41 78.68,19.96 80.7,17.95 83.44,17.95 C_O/P2.2 | 78.75,25.41 78.75,23.47 v78.72,23.43 | v51.47,19.77 51.47,21.59 C7.2 | MCU_OP-AMP.V- 10.17,35.7 v10.71,36.23 | v13.95,36.16 13.95,34.18 MCU_OP-AMP.REF
  Bottom 0.305: v34.14,8.57 v32.23,6.67 | v28.84,6.67 25.41,6.67 21.07,2.32 20.17,2.32 MCU_MEAS.5
  Bottom 0.406: v10.36,10.4 10.78,10.4 11.32,9.87 11.32,6.36 12.61,5.07 v14.36,5.07
  Bottom 0.61: v78.72,23.43 76.43,23.43 73.84,20.84 52.54,20.84 v51.47,19.77 | v10.71,36.23 13.87,36.23 v13.95,36.16
GNDA  (via drill 0.38, 0.43)
  Top 0.305: 100.93,32 101.31,31.62 CDDA2.2 CDDA1.2 101.61,27.72 U1.14 | 100.93,32 100.93,32.96 M1P.3 | M1P.2 99.64,32.03 99.71,31.97 | 99.71,31.97 99.82,31.85 100.78,31.85 100.93,32 | M1P.1 98.37,32.08 98.64,31.81 99.56,31.81 99.71,31.97
  Top 0.406: U1.14 101.61,21.41 101.38,21.18 101.35,21.18 v100.89,20.73 | v86.56,4.72 83.63,4.72 82.72,3.81 82.72,2.25 VDD_GATE.7 | v43.43,8.61 v62.41,8.61
  Bottom 0.406: v86.56,4.72 93.23,11.39 93.23,19.7 93.84,20.31 100.47,20.31 v100.89,20.73 | SEN1_ISO.2 35.69,6.69 37.6,8.61 v43.43,8.61 | v62.41,8.61 62.9,8.61 63.89,7.62 63.89,1.75 64.92,0.72 81.19,0.72 VDD_GATE.7
IN1+  (via drill 0.43)
  Top 0.406: v43.81,32.16 43.81,34.02 45.11,35.32 45.62,35.32 RFP1.1
  Top 0.61: RFP1.1 45.64,36.61 46.18,37.15 47.23,37.15 R_PRI.1
  Bottom 0.305: SEN1_CAL.1 43.69,1.32 43.02,0.72 31.74,0.72 30.14,2.25
  Bottom 0.406: 30.14,2.25 30.14,2.44 | 30.14,2.44 30.14,8.61 29.15,9.6 27.96,9.6 25.22,12.34 25.22,18.21 30.14,23.13 39.81,23.13 43.81,27.13 v43.81,32.16 | SEN1_ISO.1 30.29,2.29 30.14,2.44
IN2+  (via drill 0.38)
  Top 0.305: RFS1.1 60.29,35.52 57.07,32.31 57.07,25.98 58.22,24.84 58.22,20.88 v54.71,17.91
  Top 0.61: XER.4 93.55,31.4 93.84,31.7 93.84,37.45 92.32,38.98 67.86,38.98 67.27,38.39 R_SEC.2 66.29,37.41 65.72,36.84 65.72,35.56 RFS1.1
  Bottom 0.305: SEN2_CAL.1 49,2.32 49,14.25 52.65,17.91 v54.71,17.91
IN2-  (via drill 0.38)
  Top 0.305: v80.43,20.5 80.43,25.03 78.03,27.43 77.23,27.43 75.63,29.03 74.83,29.03 74.22,29.64 74.22,33.57 72.35,35.43 RFS2.1 | SEN2_ISO.2 40.96,3.58 41.45,4.08 49.71,4.08 SEN2_CAL.2
  Top 0.61: R_SEC.1 70.29,37.41 70.67,37.03 RFS2.1
  Bottom 0.305: 53.57,16.95 52.81,16.95 50.02,14.17 50.02,3.76 SEN2_CAL.2 | 53.57,16.95 73.53,16.95 77.08,20.5 v80.43,20.5 | 53.53,16.99 53.57,16.95
IN_SMB-  (via drill 0.38, 0.43)
  Top 0.305: v35.13,19.77 35.13,21.26 36.01,22.14 RS_SMB.2 | v51.24,14.02 48.84,13.98 v47.66,12.8
  Top 0.406: RF_SMB2.1 37.64,22.75 37.19,23.2 36.04,23.2 RS_SMB.2
  Bottom 0.305: SMB_CAL.2 62.04,1.38 61.38,0.72 54.86,0.72 54.22,1.37 54.22,2.27 | 54.22,2.27 SMB_ISO.1 | 54.22,2.27 51.44,5.82 51.44,13.53 v51.24,14.02 | v47.66,12.8 47.05,12.8 46.02,13.83 46.02,17.3 43.85,19.47 35.43,19.47 v35.13,19.77
INP+  (via drill 0.43)
  Top 0.406: CS_PRI.8 47.36,27.58 47.82,28.04 47.82,31.04 CFP.1 | CS_PRI_MCU.8 53.19,27.55 v52.46,28.27 | v46.83,29.95 46.41,29.98 46.1,30.29 46.1,31.47 46.14,31.51
  Top 0.61: RFP1.2 45.64,32 46.14,31.51 47.27,31.51 CFP.1
  Bottom 0.406: v52.46,28.27 52.46,29.83 51.93,30.37 47.47,30.37 v46.83,29.95
INP-  (via drill 0.43)
  Top 0.406: CS_PRI_MCU.1 48.96,27.55 48.77,27.74 v48.77,29.22 48.77,29.76 48.77,31.31 CFP.2 | CS_PRI.1 43.43,27.58 v44.96,29.11
  Top 0.61: CFP.2 50.06,31.55 50.6,32.08 RFP2.2
  Bottom 0.406: v44.96,29.11 48.65,29.11 v48.77,29.22
INS+  (via drill 0.43)
  Top 0.406: CS_SEC.8 64.2,27.55 63.78,27.96 63.78,29.53 66.16,31.91 | CS_SEC_MCU.8 73.11,27.58 72.77,27.93 72.77,29.83 v72.62,29.98 | v67.44,30.14 67.44,31.69 CFS.1
  Top 0.61: CFS.1 66.29,31.77 66.16,31.91 65.76,32.31 RFS1.2
  Bottom 0.406: v72.62,29.98 67.59,29.98 v67.44,30.14
INS-  (via drill 0.43)
  Top 0.406: CS_SEC_MCU.1 71.25,27.58 71.55,27.89 71.55,30.94 70.54,31.95 | CS_SEC.1 62.26,27.55 62.56,27.85 62.56,29.03 v62.83,29.3 | v67.28,28.88 69.76,28.88 70.6,29.72 70.6,31.55 70.37,31.77
  Top 0.61: CFS.2 70.37,31.77 70.54,31.95 70.67,32.08 RFS2.2
  Bottom 0.406: v62.83,29.3 66.86,29.3 v67.28,28.88
IP_OUT  (via drill 0.64)
  Top 0.61: MCU_MEAS.2 12.51,10.88 v12.46,10.94 | v13.49,16.54 13.49,22.29 v13.72,22.52 | v16.92,22.52 v19.89,22.52 | v42.33,30.37 44.54,30.37 v44.96,30.79 | CS_PRI_MCU.5 56.88,23.74 v56.92,23.77
  Bottom 0.61: v12.46,10.94 12.46,15.51 v13.49,16.54 | v13.72,22.52 v16.92,22.52 | v19.89,22.52 27.93,22.52 29.83,24.42 39.43,24.42 42.33,27.32 v42.33,30.37 | v44.96,30.79 46.1,30.79 46.9,31.59 52.39,31.59 53.76,30.21 53.76,28.77 54.79,27.74 59.05,27.74 60.05,26.75 60.05,24.92 58.9,23.77 v56.92,23.77
IS_OUT  (via drill 0.43)
  Top 0.406: CS_SEC_MCU.5 76.31,23.77 v77.19,24.65 | v30.4,18.97 25.64,18.97 24.84,18.17 v24.84,7.96
  Bottom 0.406: v77.19,24.65 77.19,25.76 76.58,26.36 76.54,26.33 67.09,26.33 66.56,25.79 66.56,22.67 65.61,21.72 51.89,21.72 51.17,20.99 45.83,20.99 45.49,20.65 32.08,20.65 v30.4,18.97 | MCU_MEAS.3 15.05,3.66 17.26,5.87 22.75,5.87 v24.84,7.96
M1B1G
  Top 0.61: M1B.2 129.67,28.93 M1BDRV.7
M1B2G
  Top 0.61: M1BDRV.5 134.49,30.9 133.01,32.38 132.3,32.38 M1B.4
M1B2S  (via drill 0.38, 0.64)
  Top 0.305: M1S.1 105.5,31.97 105.73,31.74 106.49,31.74 106.76,32 106.76,32.91 M1S.2 106.77,31.99 106.98,31.77 107.82,31.77 | 107.82,31.77 108.01,31.97 108.01,32.9 M1S.3 | 107.82,31.77 107.62,31.57 CDDB2.2 CDDB1.2 107.96,27.65 U1.9
  Top 0.406: U1.9 107.96,22.01 107.52,21.57 v106.11,21.57 | v91.86,5.6 89.04,5.6 87.97,4.53 87.97,2.43 VDD_GATE.5
  Top 0.61: M1BDRV.6 131.94,30.25 130.94,31.25 M1B.3 130.94,33.58 130.11,34.4 119.94,34.4 119.41,34.94 119.41,37.85 M1BB.5 119.41,37.9 119.41,39.17 119.22,39.36 118.42,39.36 118.11,39.05 M1BB.6 118.11,34.44 117.77,34.1 110.98,34.1 110.72,33.83 110.72,30.59 110.41,30.29 107.63,30.29 CDDB2.2 | v12.23,30.94 20.99,30.94 21.79,30.14 v21.79,26.52 | v89.5,23.16 95.78,23.16 96.77,22.17 96.77,19.62 97.27,19.13 102.41,19.13 103.94,20.65 105.19,20.65 v106.11,21.57
  Bottom 0.406: v106.11,21.57 104.85,21.57 101.88,18.59 95.9,18.59 95.21,17.91 95.21,8.95 v91.86,5.6 | 40.92,27.58 40.92,31.32
  Bottom 0.61: BB_TOP.P2 7.09,25.79 v12.23,30.94 | v21.79,26.52 21.79,25.91 22.21,25.49 38.82,25.49 40.92,27.58 40.92,31.28 | 40.92,31.32 40.92,32.12 42.71,33.91 52.2,33.91 54.9,31.2 73.3,31.2 74.14,30.37 74.14,28.38 75.09,27.43 78.79,27.43 80.09,26.14 80.09,24.12 81.04,23.16 v89.5,23.16
M1BB1G
  Top 0.61: M1BB.2 MBBDRV.7
M1BB2G
  Top 0.61: M1BB.4 120.23,32.48 121.88,30.82 121.88,28.71 MBBDRV.5
M1PG  (via drill 0.38)
  Top 0.305: U1.15 100.34,22.95 v100.7,22.59 | v102.91,31.62 102.91,32.25 M1P.4
  Bottom 0.305: v100.7,22.59 101.84,22.59 102.49,23.24 102.49,31.2 v102.91,31.62
M1SG  (via drill 0.38)
  Top 0.305: U1.10 106.69,23 v106.98,22.71 | v109.35,31.2 109.35,32.89 M1S.4
  Bottom 0.305: v106.98,22.71 108.7,22.71 109.35,23.36 v109.35,31.2
M1T1G
  Top 0.61: M1T.2 141.22,28.8 M1TDRV.7
M1T2G
  Top 0.61: M1T.4 143.76,31.42 144.67,30.52 145.88,30.52 146.27,30.14 146.27,28.77 M1TDRV.5
M1T2S  (via drill 0.43, 0.64)
  Top 0.406: SEN2_ISO.1 38.42,1.32 39.01,0.72 77.53,0.72 78.83,2.02
  Top 0.61: M1TDRV.6 143.6,28.71 143.6,29.87 142.49,30.98 M1T.3 142.49,33.91 141.92,34.48 131.75,34.48 130.87,35.36 121.08,35.36 120.62,35.81 120.62,39.36 119.63,40.35 117.92,40.35 116.78,39.2 | 116.78,39.2 116.59,39.4 115.79,39.4 115.57,39.18 M1BB.8 112.1,37.88 v111.4,37.19 | 116.78,39.2 116.78,37.94 M1BB.7 | 78.83,2.02 78.83,16.99 v79.29,17.45
  Bottom 0.61: v111.4,37.19 105.23,37.19 104.05,36.01 92.39,36.01 91.25,34.86 91.25,26.36 | v79.29,17.45 89.34,17.45 91.25,19.36 91.25,26.36 | BB_TOP.P1 6.31,28.33 9.18,30.75 9.18,37.22 11.05,39.13 20.04,39.13 23.05,36.12 28.46,36.12 30.63,38.29 81.34,38.29 82.83,36.8 82.83,27.32 84.28,25.87 90.75,25.87 91.25,26.36
N$1
  Top 0.61: M1T.8 139.95,39.18 140.17,39.4 141.01,39.4 141.01,39.32 141.26,39.07 | 141.26,39.07 141.28,39.05 141.28,37.93 M1T.7 | M1T.6 142.49,39.2 | 142.49,39.2 142.26,39.43 141.62,39.43 141.26,39.07 | M1T.5 143.76,39.23 143.6,39.4 142.69,39.4 142.49,39.2
N$2
  Top 0.61: R5.2 140.97,18.95 M1TDRV.2
N$3
  Top 0.61: M1P.MB2 101.83,38.45 M1P.MB 98.95,38.22 98.73,38.45 M1P.MB1
  Top 1.016: XER.3 94.54,27.9 95.14,28.5 95.14,36.08 97.46,38.41 98.77,38.41 98.95,38.22
N$4
  Top 0.61: R6.2 146.43,18.82 M1TDRV.4
N$5
  Top 0.61: M1B.8 128.4,39.2 128.63,39.43 129.46,39.43 129.69,39.2 129.69,37.9 M1B.7 129.67,38.95 130.11,39.51 130.72,39.47 130.87,39.32 130.91,37.9 M1B.6 130.94,39.12 131.25,39.51 132.06,39.55 132.21,39.47 M1B.5
N$6
  Top 0.61: R9.2 MBBDRV.2
N$7  (via drill 0.64)
  Top 0.61: M1S.MB2 108.95,38.4 M1S.MB 105.85,38.4 M1S.MB1 104.43,38.4 v103.86,37.83 | v86.26,27.81 82.51,27.81 XER.2
  Bottom 0.61: v103.86,37.83 89,37.83 86.98,35.81 86.98,28.54 v86.26,27.81
N$8
  Top 0.61: R10.2 MBBDRV.4
N$9
  Top 0.61: R8.2 M1BDRV.4
N$10  (via drill 0.38, 0.64)
  Top 0.305: 65.96,7.47 28.19,7.47 v27.81,7.85 | v18.06,26.98 18.06,28.73 LAB_OP-AMP.VOUT
  Top 0.61: 65.96,7.47 RF_AMP.1
  Bottom 0.305: v18.06,26.98 18.06,19.39 19.85,17.6 19.85,13.3 21.45,11.7 23.47,11.7 23.47,10.78 26.4,7.85 v27.81,7.85
N$11
  Top 0.61: R7.2 M1BDRV.2
N$13  (via drill 0.64)
  Top 0.61: SMB_ISO.2 56.77,3.31 55.21,4.88 v26.75,4.88
  Bottom 0.61: CELL_BOT.P1 23.85,2.56 23.85,3.66 25.07,4.88 v26.75,4.88
N$21
  Top 0.61: LDO_LABVIEW.4 19.77,9.75 C_BYP1.2
N$23
  Top 0.305: LDO_MCU.4 89.46,13.03 C_BYP2.2
PD10
  Top 0.305: BB_CON.4 134.62,7.11 134.99,6.74 138.99,6.74 141.05,8.8 141.05,14.57 R5.1
PD11  (via drill 0.38)
  Top 0.305: R6.1 146.43,11.1 v145.09,9.75
  Bottom 0.305: v145.09,9.75 137.77,9.75 137.69,9.68 133.32,9.68 BB_CON.5
PD12  (via drill 0.38)
  Top 0.305: BB_CON.3 134.1,10.92 133.43,10.25 133.43,6.06 v132.36,4.99 | U1.1 99.07,13.99 v98.64,13.56
  Bottom 0.305: v132.36,4.99 132.28,4.92 109.8,4.92 106.45,8.27 99.86,8.27 98.64,9.49 v98.64,13.56
PD13
  Top 0.305: BB_CON.6 131.67,8.38 130.91,9.14 130.91,13.14 R7.1
PD14  (via drill 0.38)
  Top 0.305: v134.53,13.22 134.53,14.61 R8.1
  Bottom 0.305: BB_CON.7 129.54,12 130.42,12.88 134.19,12.88 v134.53,13.22
PE3  (via drill 0.38)
  Top 0.305: v118.42,12.84 117.5,12.84 116.85,13.49 116.85,14.63 R9.1
  Bottom 0.305: BB_CON.8 129.31,8.38 128.28,9.41 128.28,12.42 127.86,12.84 v118.42,12.84
PE4
  Top 0.305: BB_CON.9 127,13.78 126.11,14.67 121.94,14.67 R10.1
PE5  (via drill 0.38)
  Top 0.305: v100.58,17.6 100.36,17.37 100.36,15.59 U1.2
  Bottom 0.305: BB_CON.10 127,6.3 126.42,5.71 110.07,5.71 107.1,8.69 107.1,16.27 105.69,17.68 100.66,17.68 v100.58,17.6
SMB  (via drill 0.38)
  Top 0.305: CS_SMB1.5 42.25,10.29 v42.06,10.1 | v31.28,3.73 31.28,1.83 30.06,0.72 19.27,0.72 MCU_MEAS.4
  Bottom 0.305: v42.06,10.1 42.06,10.06 41.19,9.18 36.73,9.18 v31.28,3.73
SMB+  (via drill 0.43)
  Top 0.406: RF_SMB1.2 32.69,18.59 33.26,18.02 CF_SMB.1 34.33,15.39 | CS_SMB.8 34.1,15.16 34.33,15.39 | CS_SMB1.8 v40.08,15.2 | v35.01,15.32 34.4,15.32 34.33,15.39
  Bottom 0.406: v40.08,15.2 35.13,15.2 v35.01,15.32
SMB-  (via drill 0.43)
  Top 0.406: RF_SMB2.2 37.64,18.44 37.22,18.02 CF_SMB.2 36.01,18.01 36.01,17.07 v36.01,16.57 36.01,15.54 36.35,15.2 CS_SMB1.1 | CS_SMB.1 30.14,15.16 v31.47,16.5
  Bottom 0.406: v31.47,16.5 35.93,16.5 v36.01,16.57
SMB_OUT  (via drill 0.38, 0.64)
  Top 0.61: CS_SMB.5 34.52,11.35 v35.2,12.04 | v43.51,10.17 45.38,10.17 46.9,11.7 v66.45,11.7
  Bottom 0.61: LAB_MEAS.4 73.79,8.85 71.93,10.71 67.44,10.71 66.71,11.43 v66.45,11.7 | v35.2,12.04 35.2,13.34 35.93,14.06 42.41,14.06 43.02,13.45 43.02,10.67 v43.51,10.17
VAMP
  Top 0.61: LAB_MEAS.1 66.17,5.56 RF_AMP.2 67.36,5.6 68.77,7.01 70.29,7.01 71.25,7.96 CF_AMP.1
VDD1,2  (via drill 0.38, 0.43)
  Top 0.305: v107.94,13.83 107.94,15.55 U1.8
  Top 0.406: C4.1 100.27,11.24 | 100.27,11.24 C3.1 100.28,12.39 100.28,12.99 101.61,14.33 U1.3 101.61,17.45 102.15,17.98 104.01,17.98 v104.55,18.52 | C9.1 40.16,9.4 40.16,11.81 40.5,12.15 40.5,12.19 40.97,12.66 CS_SMB1.6 45.63,12.66 v45.76,12.54 | v46.83,9.6 68.39,9.6 v69.53,8.46 | v69.95,5.87 69.95,5.26 70.41,4.8 74.3,4.8 v75.06,5.56 | v89.57,11.35 100.15,11.35 100.27,11.24
  Bottom 0.305: BB_CON.1 137.16,13.75 136.44,14.48 133.69,14.48 132.89,13.68 108.09,13.68 v107.94,13.83
  Bottom 0.406: v104.55,18.52 107.33,18.52 107.97,17.87 107.97,13.87 v107.94,13.83 | v45.76,12.54 45.76,10.67 v46.83,9.6 | v69.53,8.46 69.53,7.7 69.95,7.28 v69.95,5.87 | v75.06,5.56 83.78,5.56 v89.57,11.35
VDDA  (via drill 0.38)
  Top 0.305: CDDA2.1 CDDA1.1 99.07,27.5 U1.16
  Top 0.406: U1.16 99.07,22 v98.49,21.41
  Bottom 0.406: v98.49,21.41 93.31,21.41 92.28,20.38 92.28,12.19 85.19,5.11 VDD_GATE.6
VDDB  (via drill 0.38)
  Top 0.305: CDDB2.1 CDDB1.1 105.42,27.5 U1.11
  Top 0.406: U1.11 105.42,22.44 104.97,21.98 102.95,21.98 v102.91,21.95
  Bottom 0.406: VDD_GATE.4 90.26,2.2 90.26,6.25 94.22,10.21 94.22,18.82 94.83,19.43 101.58,19.43 102.87,20.73 102.87,21.91 v102.91,21.95
VOUT  (via drill 0.64)
  Top 0.61: v11.43,27.05 11.43,28.73 MCU_OP-AMP.VOUT
  Bottom 0.61: MCU_MEAS.1 9.97,8.17 7.7,10.44 4.92,10.44 1.18,14.17 1.18,21.41 2.44,22.67 10.25,22.67 11.43,23.85 v11.43,27.05

### Text on the board
tNames: + | CELL | B+ | Op-amp / MCU | Op-amp / LabVIEW | B+ | B- | B- | + | CELL | 1 | 1 | SEN1 / ISO | SEN2 / ISO | SEN1 / CAL | SEN2 / CAL | SMB / ISO | SMB / CAL | *